# Altium schematic sheet Input.SchDoc
size A4
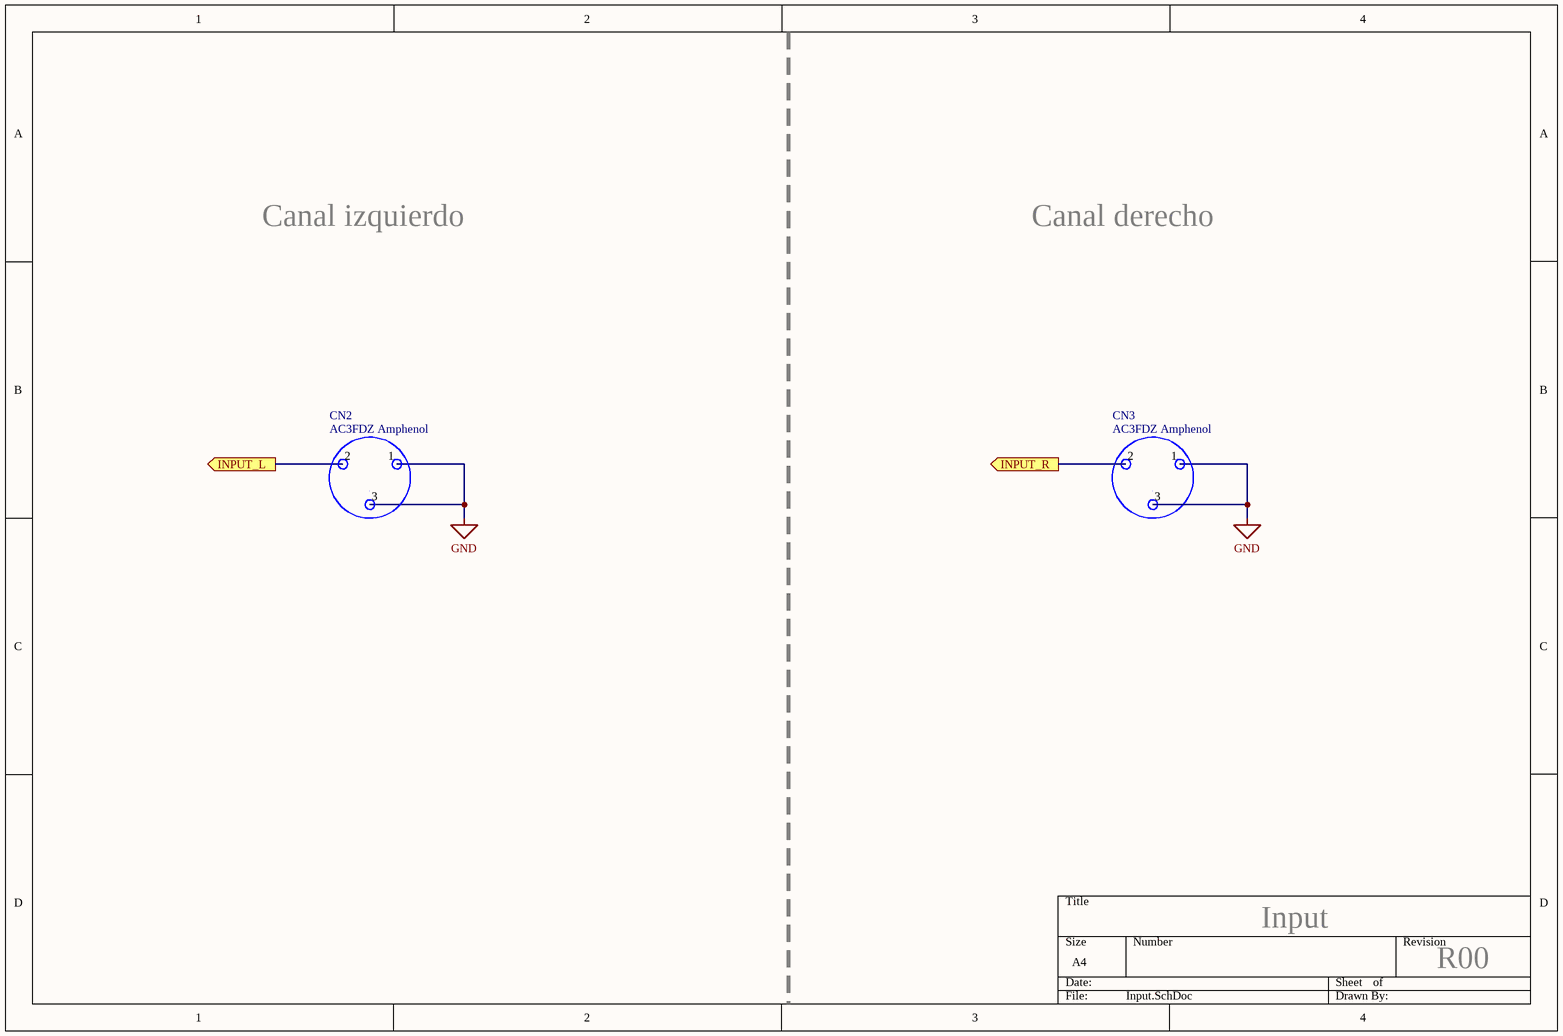
[diagram p0: Input.SchDoc]

## Parts
CN2  AC3FDZ Amphenol  [XLR_Ext]
CN3  AC3FDZ Amphenol  [XLR_Ext]

## Ports
INPUT_L (out), INPUT_R (out)

## Nets
GND: CN2.1(Chasis) CN2.3(Cold) CN3.1(Chasis) CN3.3(Cold)
INPUT_L: CN2.2(Hot) ; port INPUT_L
INPUT_R: CN3.2(Hot) ; port INPUT_R

## Notes on the sheet
- Canal izquierdo
- Canal derecho
- Input
- R00

## Library data of the parts
CN2 CN3 = XLR_hembra: XLR connector (canon) hembra